# Altium schematic sheet humidity.SchDoc
size A4
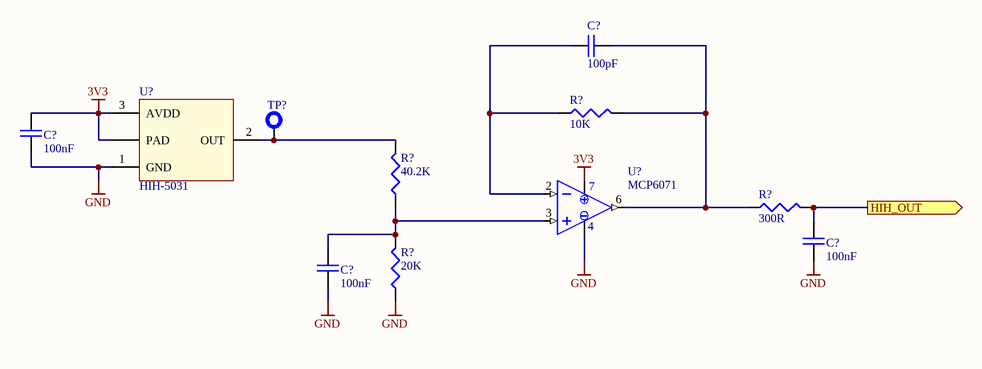
[diagram p0: humidity.SchDoc]

## Parts
(Parts that share a designator on the sheet are numbered #1, #2 ... from top to bottom, then left to right.)
C?#1  100pF  [0603]
C?#2  100nF  [0603]
C?#3  100nF  [0603]
C?#4  100nF  [0603]
R?#1  10K  [0603]
R?#2  40.2K  [0603]
R?#3  300R  [0603]
R?#4  20K  [0603]
TP?  Test Point  [TERMINAL]  (value not drawn)  (no BOM)
U?#1  HIH-5031  [HIH]
U?#2  MCP6071  [SOIC-8]

## Ports
HIH_OUT (out)

## Nets
3V3: C?#2.2 U?#1.3(AVDD) U?#1.PAD U?#2.7(VDD)
GND: C?#2.1 C?#3.1 C?#4.1 R?#4.1 U?#1.1(GND) U?#2.4(VSS)
HIH_OUT: C?#3.2 R?#3.2 ; port HIH_OUT
NetC?#1_1: C?#1.1 R?#1.1 U?#2.2(INN)
NetC?#1_2: C?#1.2 R?#1.2 R?#3.1 U?#2.6(VOUT)
NetC?#4_2: C?#4.2 R?#2.1 R?#4.2 U?#2.3(INP)
NetR?#2_2: R?#2.2 TP?.1(TP) U?#1.2(OUT)

## Library data of the parts
C?#1-C?#4 = CAP: Capacitor; Owner: Nuno Brum; Sub-Type: Ceramic; Assembly: INS; Maximum Voltage: *; Creation Date: 2005-04-28; Status: Valid; Validation date: 2006-05-15; Type: Capacitor
R?#1-R?#4 = RES: Resistor; Owner: Nuno Brum; Sub-Type: Generic; Assembly: INS; Validation date: 2006-05-15; Creation Date: 2002-07-17; Status: Valid; Power: *; Type: Resistor
TP? = TEST-PROBE: Test/Probe Point; Owner: Nuno Brum; Sub-Type: Mechanical; Assembly: PCB; Validation Date: 2006-05-15; Type: PCB; Creation Date: 2005-06-01; Status: Valid
U?#1 = HIH-5031: Low Voltage Humidity Sensor; Type: IC; Creation Date: 2012-03-05
U?#2 = MCP6V26: Low-Offset Opamp; Type: IC; Creation Date: 2012-03-15